# Altium schematic sheet IP_12081213.SchDoc
size A4
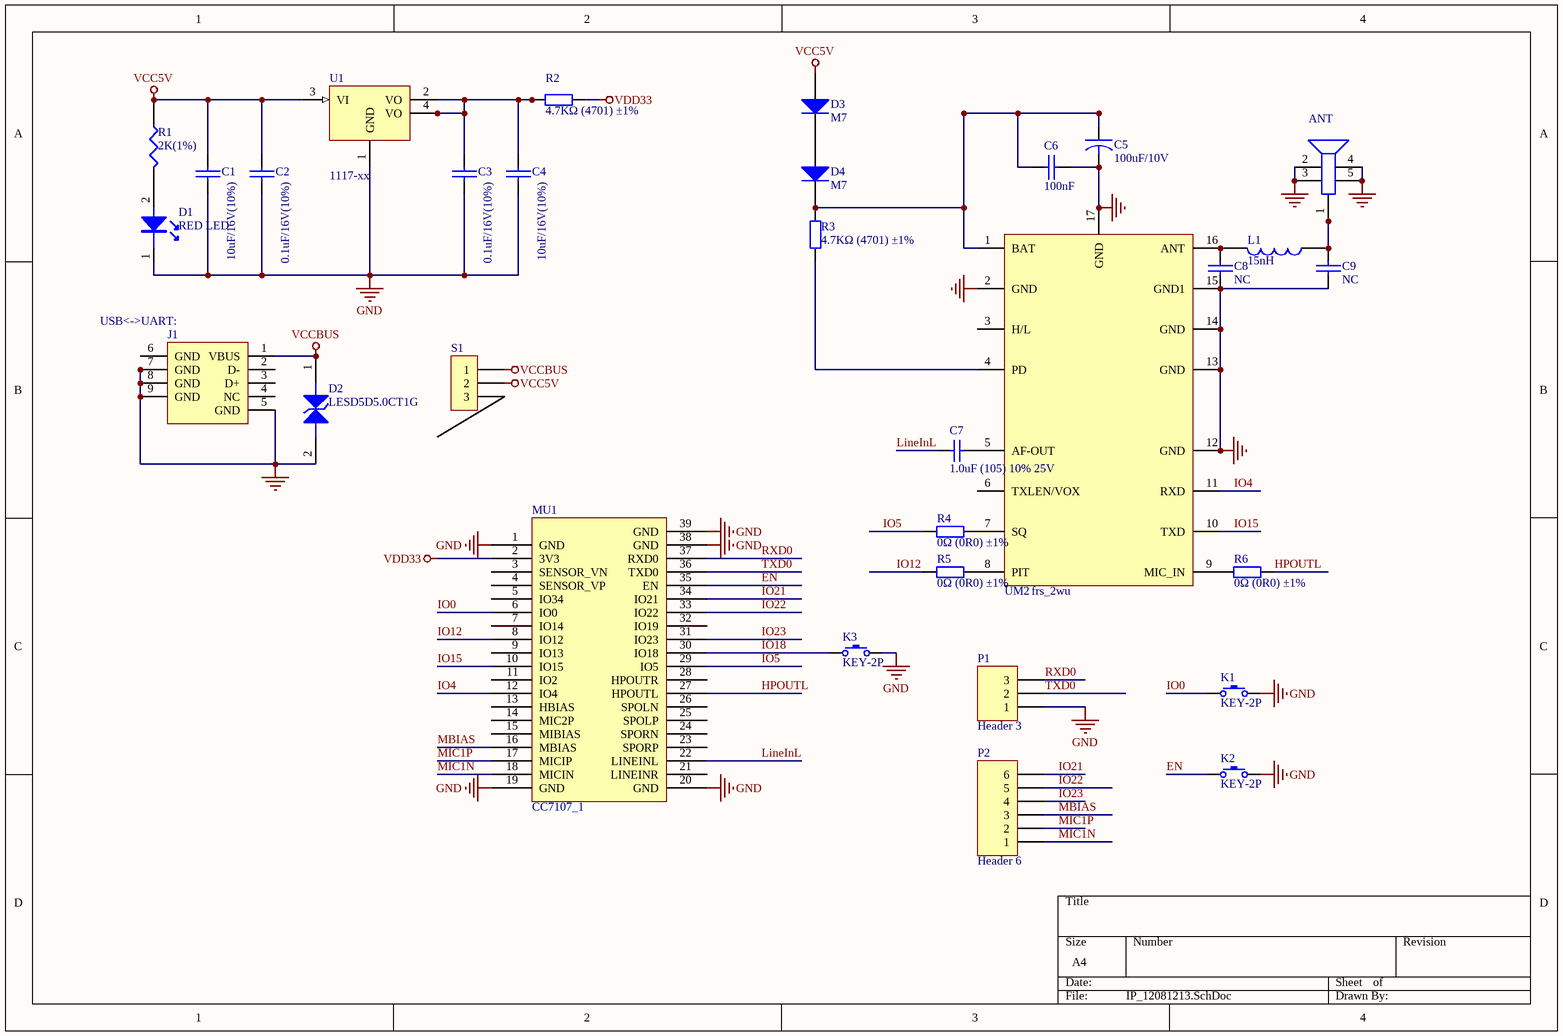
[diagram p0: IP_12081213.SchDoc]

## Parts
ANT  (no value)  [SMA-kHD信号输入头长 5.1宽5.1 5脚]
C1  10uF/16V(10%)  [LC-0603_C]
C2  0.1uF/16V(10%)  [LC-0402_C]
C3  0.1uF/16V(10%)  [LC-0402_C]
C4  10uF/16V(10%)  [LC-0603_C]
C5  100uF/10V  [3216]
C6  100nF  [LC-0402_C]
C7  1.0uF (105) 10% 25V  [LC-0402_C]
C8  NC  [LC-0402_C]
C9  NC  [LC-0402_C]
D1  RED LED  [LED5MM 2.6 6]
D2  LESD5D5.0CT1G  [LC-SOD-523]
D3  M7  [SMA]
D4  M7  [SMA]
J1  (no value)  [USB MICRO5P/F B型牛角 - 3D]
K1  KEY-2P  [key - 1]
K2  KEY-2P  [key - 1]
K3  KEY-2P  [KE卧式带支架 6*6*4.3/5/6/7/8/9.5 2脚侧按微动]
L1  15nH  [LC-1206_L]
MU1  CC7107_1  [ESP32-A1S]
P1  Header 3  [HDR1X3]
P2  Header 6  [HDR1X6]
R1  2K(1%)  [LC-0402_R]
R2  4.7KΩ (4701) ±1%  [LC-0402_R]
R3  4.7KΩ (4701) ±1%  [LC-0402_R]
R4  0Ω (0R0) ±1%  [LC-0402_R]
R5  0Ω (0R0) ±1%  [LC-0402_R]
R6  0Ω (0R0) ±1%  [LC-0402_R]
S1  (no value)  [K 两档开关SS-21D00]
U1  1117-xx  [SOT223 LM1117]
UM2  frs_2wu  [模块HKT-82-VER02]

## Nets
GND: ANT.2 ANT.3 ANT.4 ANT.5 C1.2 C2.2 C3.2 C4.2 C5.2 C6.2 C8.2 C9.2 D1.1(C) D2.2(K) J1.5(GND) J1.7(GND) J1.8(GND) J1.9(GND) K1.2 K2.2 K3.2 MU1.1(GND) MU1.19(GND) MU1.20(GND) MU1.38(GND) MU1.39(GND) P1.1 U1.1(GND) UM2.2(GND) UM2.12(GND) UM2.13(GND) UM2.14(GND) UM2.15(GND1) UM2.17(GND)
VCC5V: C1.1 C2.1 D3.1(A) R1.1 S1.2 U1.3(VI)
VCCBUS: D2.1(A) J1.1(VBUS) S1.1
VDD33: MU1.2(3V3) R2.2
EN: K2.1 MU1.35(EN)
HPOUTL: MU1.27(HPOUTL) R6.2
IO0: K1.1 MU1.6(IO0)
IO4: MU1.12(IO4) UM2.11(RXD)
IO5: MU1.29(IO5) R4.1
IO12: MU1.8(IO12) R5.1
IO15: MU1.10(IO15) UM2.10(TXD)
IO18: K3.1 MU1.30(IO18)
IO21: MU1.34(IO21) P2.6
IO22: MU1.33(IO22) P2.5
IO23: MU1.31(IO23) P2.4
LineInL: C7.1 MU1.22(LINEINL)
MBIAS: MU1.16(MBIAS) P2.3
MIC1N: MU1.18(MICIN) P2.1
MIC1P: MU1.17(MICIP) P2.2
RXD0: MU1.37(RXD0) P1.3
TXD0: MU1.36(TXD0) P1.2
NetANT_1: ANT.1 C9.1 L1.2
NetC3_1: C3.1 C4.1 R2.1 U1.2(VO) U1.4(VO)
NetC5_1: C5.1 C6.1 D4.2(K) R3.2 UM2.1(BAT)
NetC7_2: C7.2 UM2.5(AF-OUT)
NetC8_1: C8.1 L1.1 UM2.16(ANT)
NetD1_2: D1.2(A) R1.2
NetD3_2: D3.2(K) D4.1(A)
NetR3_1: R3.1 UM2.4(PD)
NetR4_2: R4.2 UM2.7(SQ)
NetR5_2: R5.2 UM2.8(PIT)
NetR6_1: R6.1 UM2.9(MIC_IN)

Not connected (* = marked no-connect by the designer): J1 2(D-) 3(D+) 4(NC) 6(GND); MU1 3(SENSOR_VN) 4(SENSOR_VP) 5(IO34) 7(IO14) 9(IO13) 11(IO2) 13(HBIAS) 14(MIC2P) 15(MIBIAS) 21(LINEINR) 23(SPORP) 24(SPORN) 25(SPOLP) 26(SPOLN) 28(HPOUTR) 32(IO19); S1 3; UM2 3(H/L) 6(TXLEN/VOX)

## Notes on the sheet
- (near J1) USB<->UART:

## Library data of the parts
ANT = SPEAKER1
C1-C4 C6 C8 C9 = CAP: Capacitor
C5 = CAPACITOR
C7 = 0402 1.0uF (105) 10% 25V: 贴片电容; ComponentLink1Description: 供应商链接; ComponentLink1URL: http://www.szlcsc.com/product/details_53938.html; Package: 0402; Supplier: LC; SuppliersPartNumber: C52923
D1 = LEDA: LED, SMD, GREEN, 3x2.2mm; Text Field1: LUMEX; Text Field2: DIGIKEY#67-1369-1-ND
D2 = LESD5D5.0CT1G: Zener Diode
D3 D4 = SMA(DO-214AC) M7: 二极管; ComponentLink1Description: 供应商链接; ComponentLink1URL: http://www.szlcsc.com/product/details_2841.html; Package: SMA(DO-214AC); Supplier: LC; SuppliersPartNumber: C2464
J1 = USB_CON8
K1-K3 = KEY-2P: Key
L1 = INDUCTOR
P1 = Header 3: Header, 3-Pin; LatestRevisionDate: 17-Jul-2002; LatestRevisionNote: Re-released for DXP Platform.; Publisher: Altium Limited
P2 = Header 6: Header, 6-Pin; LatestRevisionDate: 17-Jul-2002; LatestRevisionNote: Re-released for DXP Platform.; Publisher: Altium Limited
R1 = RES1
R2 R3 = 0402 4.7KΩ (4701) 1%: 贴片电阻; ComponentLink1Description: 供应商链接; ComponentLink1URL: http://www.szlcsc.com/product/details_26643.html; Package: 0402; Supplier: LC; SuppliersPartNumber: C25900
R4-R6 = 0402 0Ω (0R0) 1%: 贴片电阻; ComponentLink1Description: 供应商链接; ComponentLink1URL: http://www.szlcsc.com/product/details_17853.html; Package: 0402; Supplier: LC; SuppliersPartNumber: C17168
S1 = CON3: Connector
U1 = 1117: Linear Regulator
UM2 = IC